# EasyEDA Pro project 4090_Portable_Fan.epro, schematic Schematic1_3
Board Name: 单节电池主板; Create Date: 2025-02-24; Page Name: P1; Project Name: 基于STC8G的风扇控制主板; Schematic Name: Schematic1; Update Date: 2025-12-03; BladeWidth: 10; Company: 嘉立创EDA; Page Size: A4; RegionStart: 1; ShowBorder: 1; TitleBlock: 1; TitleBlockPosition: 3; Version: V1.0; XRegionCount: 6; YRegionCount: 4
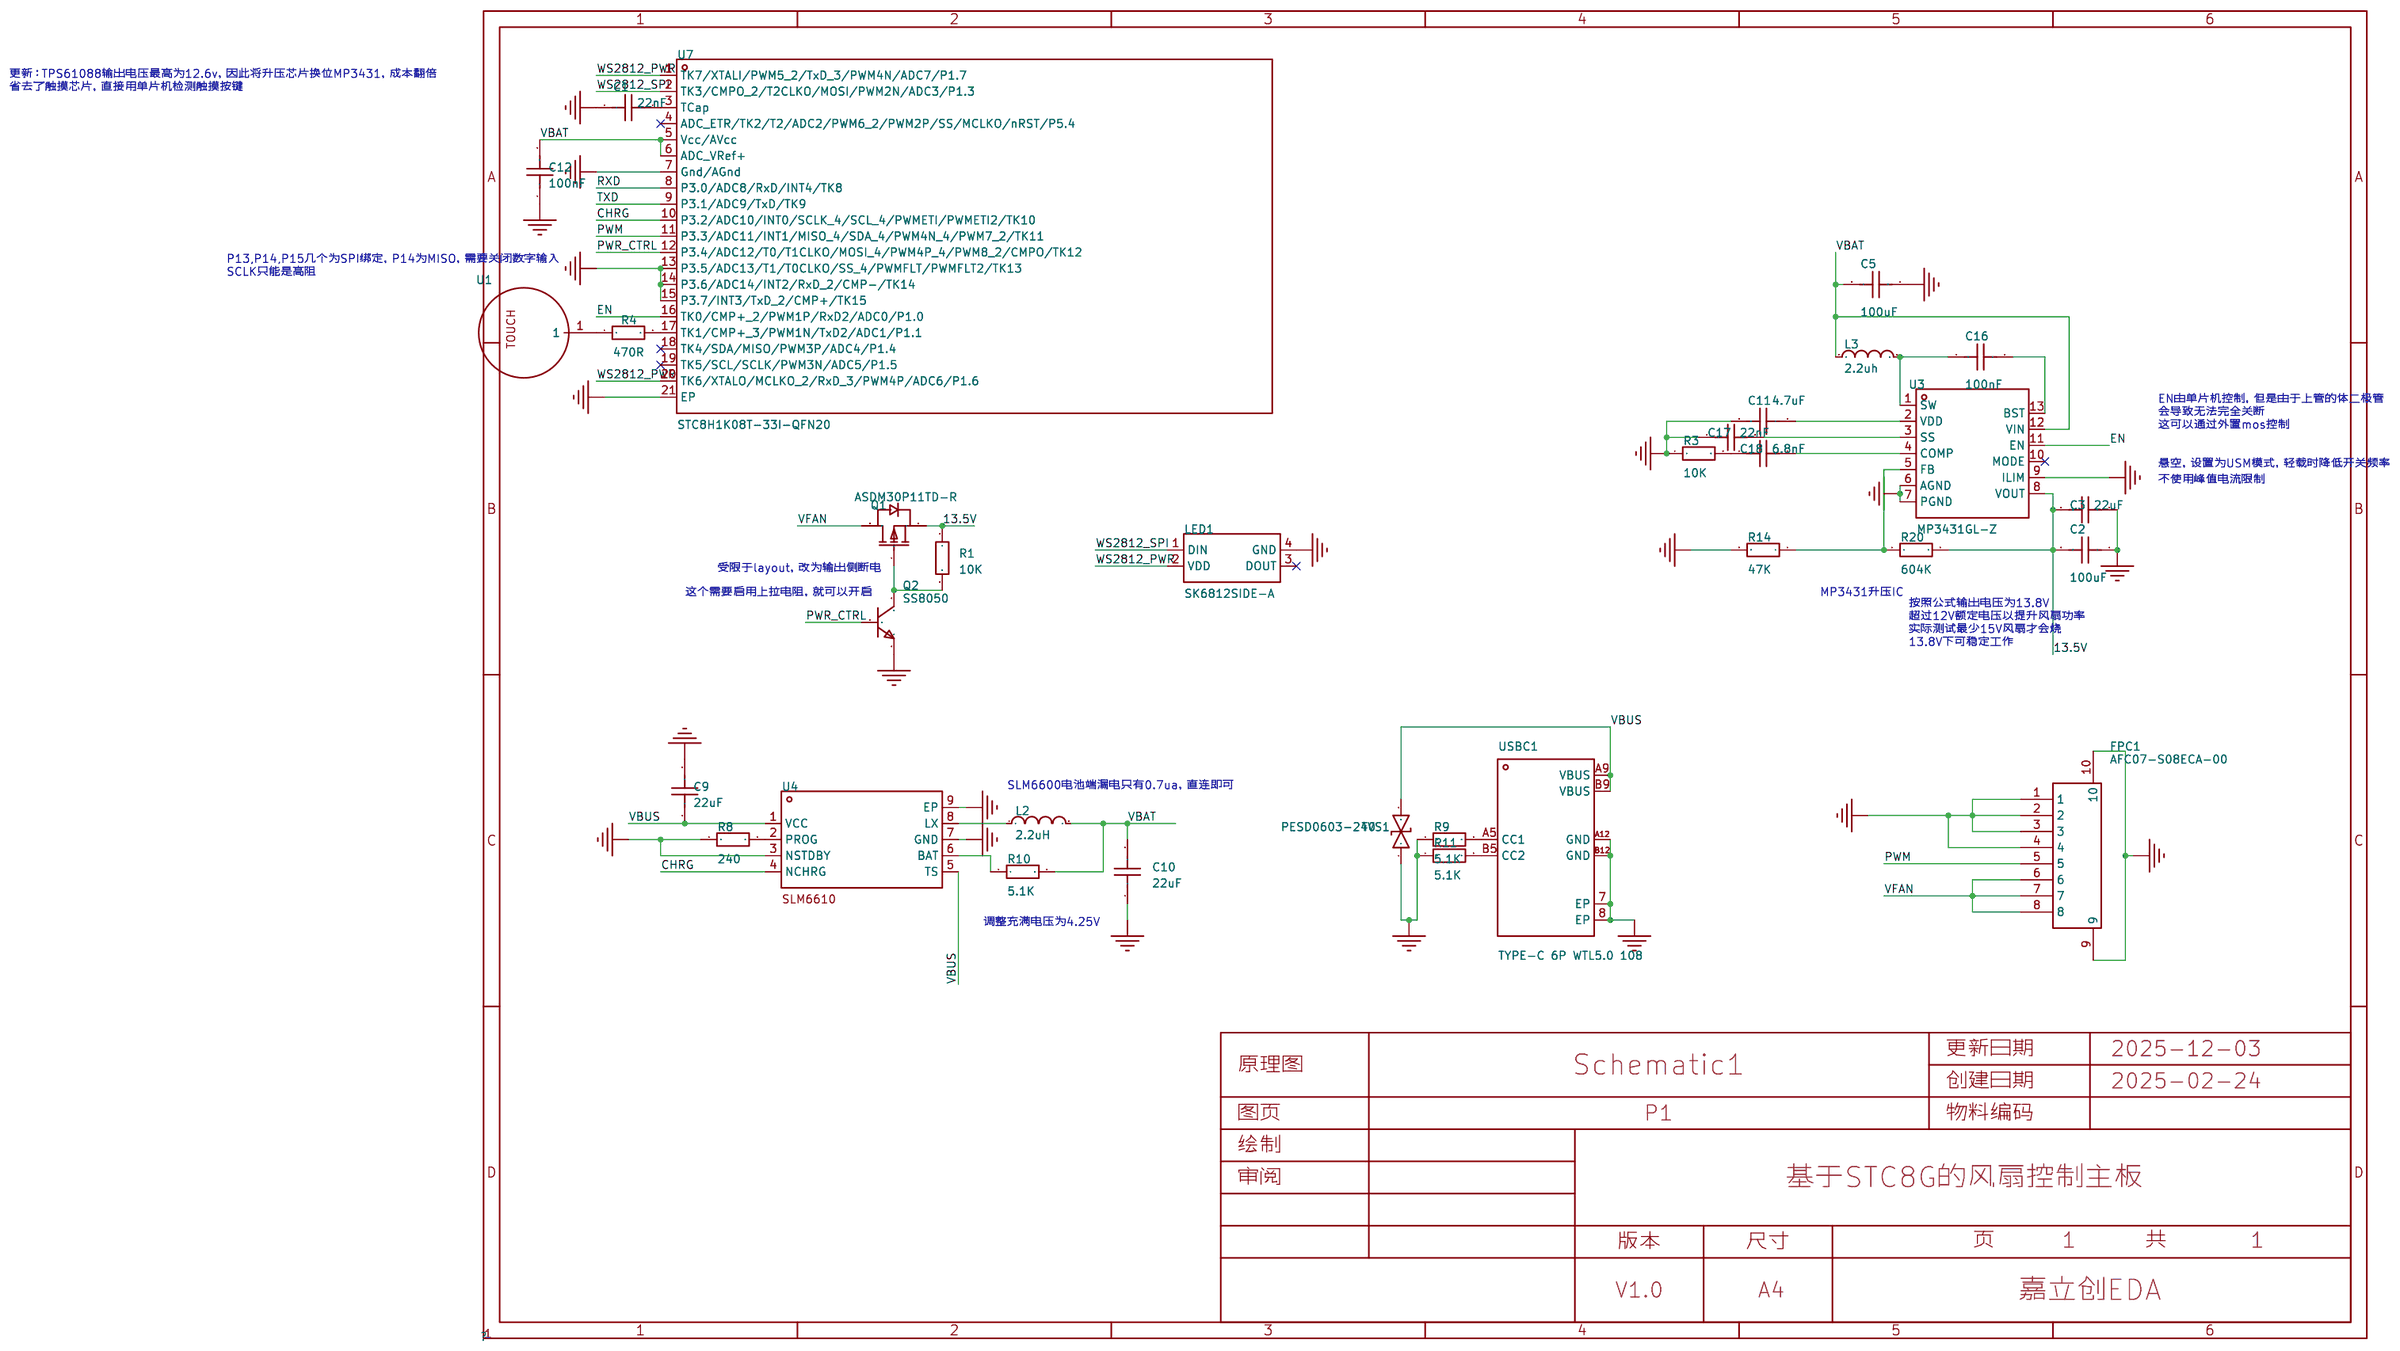
[diagram p0: schematic sheet]

## Parts
C1  22nF  [0805_S]
C2  100uF  [C1210]
C3  22uF  [0805_S]
C5  100uF  [C1210]
C9  22uF  [0805_S]
C10  22uF  [0805_S]
C11  4.7uF  [0805_S]
C12  100nF  [0805_S]
C16  100nF  [0805_S]
C17  22nF  [0805_S]
C18  6.8nF  [0805_S]
FPC1  AFC07-S08ECA-00  [FPC-SMD_P0.5-8P_LCS-SH-H2.0]
L2  2.2uH  [IND-SMD_L7.0-W6.6]
L3  2.2uh  [IND-SMD_L7.0-W6.6_MCW-0650-220]
LED1  SK6812SIDE-A  [LED-SMD_4P-L4.0-W1.6-L]
Q1  ASDM30P11TD-R  [DFN-8_L3.0-W3.0-P0.65-BL]
Q2  SS8050  [SOT-23-3_L2.9-W1.3-P1.90-LS2.4-BR]
R1  10K  [0805_S]
R3  10K  [0805_S]
R4  470R  [0805_S]
R8  240  [0805_S]
R9  5.1K  [0805_S]
R10  5.1K  [0805_S]
R11  5.1K  [0805_S]
R14  47K  [0805_S]
R20  604K  [0805_S]
TVS1  PESD0603-240  [D0603-BI]
U1  -  [F9-10-6-0.4喇叭口无针触摸弹簧]
U3  MP3431GL-Z  [QFN-13_L3.0-W4.0-P0.50-BL]
U4  -  [DFN-8_L3.0-W3.0-P0.65-BL-EP_AOZ6662DI]
U7  STC8H1K08T-33I-QFN20  [QFN-20_L3.0-W3.0-P0.40-TL-EP1.5]
USBC1  TYPE-C 6P WTL5.0 108  [USB-C-SMD_TYPE-C-6P-WTL5.0-108]

## Library data of the parts
C1 C3 C9-C12 C16-C18 = CAP_0603: Supplier Footprint: 0603
C2 C5 = HGC1210R5107M160NSVK: 容值:100uF;精度:±20%;额定电压:16V;温度系数:X5R;; LCSC Part Name: 100uF ±20% 16V; Supplier Part: C7432790; Manufacturer: Chinocera(华瓷); Supplier Footprint: 1210; JLCPCB Part Class: Extended Part; Datasheet: https://item.szlcsc.com/datasheet/HGC1210R5107M160NSVK/8438272.html; Supplier: LCSC; Tolerance: ±20%; Voltage Rating: 16V; Temperature Coefficient: X5R
FPC1 = AFC07-S08ECA-00: 锁定特性:抽屉式;触点类型:上接;触点数量:8P;间距:0.5mm;安装类型:卧贴;; LCSC Part Name: 间距:0.5mm P数:8P 抽屉式 上接; Supplier Part: C262581; Manufacturer: JS(钜硕电子); Supplier Footprint: SMD,P=0.5mm,卧贴; JLCPCB Part Class: Extended Part; Datasheet: https://atta.szlcsc.com/upload/public/pdf/source/20190726/C11082_A2E7B12387019CE4314BB5199EE0FDF4.pdf; Supplier: LCSC; Locking Feature: 抽屉式; Contact Type: 上接; Number of Contacts: 8P; Pitch: 0.5mm; Mounting Type: 卧贴; FFC, FCB Thickness: 0.3mm; Height Above Board: 2mm
L2 = FXL0630-2R2-M: 电感值:2.2uH;精度:±20%;额定电流:9.5A;饱和电流(Isat):10A;类型:一体成型电感;; LCSC Part Name: 2.2uH ±20% 10A; Supplier Part: C167218; Manufacturer: cjiang(长江微电); Supplier Footprint: SMD,6.6x7mm; JLCPCB Part Class: 扩展库; Datasheet: https://atta.szlcsc.com/upload/public/pdf/source/20240426/3189EA8206330E2108542F9E34E540E7.pdf; Supplier: LCSC; Tolerance: ±20%; Rated Current: 9.5A; Saturation Current (Isat): 10A; DC Resistance (DCR): 15mΩ; Type: 一体成型电感
L3 = FXL0650-2R2-M: 电感值:2.2uH;精度:±20%;额定电流:9A;饱和电流(Isat):11A;类型:一体成型电感;; LCSC Part Name: 2.2uH ±20% 11A; Supplier Part: C475528; Manufacturer: cjiang(长江微电); Supplier Footprint: SMD,6.6x7mm; JLCPCB Part Class: Extended Part; Datasheet: https://atta.szlcsc.com/upload/public/pdf/source/20240426/3189EA8206330E2108542F9E34E540E7.pdf; Supplier: LCSC; Tolerance: ±20%; Rated Current: 9A; Saturation Current (Isat): 11A; DC Resistance (DCR): 12.5mΩ; Type: 一体成型电感
LED1 = SK6812SIDE-A_C5378721: Supplier Part: C5378721; Manufacturer: 欧思科光电; Supplier Footprint: SMD-4P,4x1.6mm; JLCPCB Part Class: Extended Part; Datasheet: https://item.szlcsc.com/datasheet/SK6812SIDE-A/6242292.html; Supplier: LCSC
Q1 = ASDM30P11TD-R: 数量:1个P沟道;漏源电压(Vdss):30V;连续漏极电流(Id):55A;导通电阻(RDS(on)):8mΩ@10V;耗散功率(Pd):31.2W;阈值电压(Vgs(th)):2.5V@250uA;; LCSC Part Name: P沟道,电流:-55A,耐压:-30V; Supplier Part: C2758227; Manufacturer: ASDsemi(安森德); Supplier Footprint: DFN-8(3x3); JLCPCB Part Class: 扩展库; Datasheet: https://item.szlcsc.com/datasheet/ASDM30P11TD-R/2875934.html; Supplier: LCSC; Number: 1个P沟道; Drain to Source Voltage: 30V; Current - Continuous Drain(Id): 55A; RDS(on): 8mΩ@10V; Pd - Power Dissipation: 31.2W; Gate Threshold Voltage (Vgs(th)): 2.5V@250uA; Gate Charge(Qg): 61nC@10V; Input Capacitance(Ciss): 3.482nF; Reverse Transfer Capacitance (Crss@Vds): 309pF; Operating Temperature: -55℃~+150℃; Type: P沟道; Output Capacitance(Coss): 400pF
Q2 = SS8050_C7420370: 晶体管类型:NPN;集电极电流(Ic):1.5A;集射极击穿电压(Vceo):25V;耗散功率(Pd):300mW;直流电流增益(hFE):120@100mA,1.0V;; LCSC Part Name: H档 200-350 NPN 电流:1.5A 电压:25V; Supplier Part: C7420370; Manufacturer: R+O(宏嘉诚); Supplier Footprint: SOT-23; JLCPCB Part Class: Extended Part; Datasheet: https://item.szlcsc.com/datasheet/SS8050/8397192.html; Supplier: LCSC; type: NPN; Current - Collector(Ic): 1.5A; Collector - Emitter Voltage VCEO: 25V; Pd - Power Dissipation: 300mW; DC Current Gain: 120@100mA,1.0V; Transition frequency(fT): 100MHz; Current - Collector Cutoff: 100nA; Vce Saturation(VCE(sat)): 500mV; Operating Temperature: -55℃~+150℃; Emitter-Base Voltage(Vebo): 5V
R1 R8-R11 = Res_0603: Supplier Footprint: 0603
R3 R4 R14 R20 = Res_604: Supplier Footprint: 0603
TVS1 = PESD0603-240_C2929617: 钳位电压:45V;击穿电压:-;; Supplier Part: C2929617; Manufacturer: Littelfuse(美国力特); Supplier Footprint: 0603; JLCPCB Part Class: 扩展库; Datasheet: https://atta.szlcsc.com/upload/public/pdf/source/20180516/C207186_7CE2F9DCABF8CE4AA3105E54FFDB24F6.pdf; Supplier: LCSC; Clamping Voltage: 45V; Number of Channels: 单路; Type: ESD
U1 = F9-10-6-0.4喇叭口无针触摸弹簧
U3 = MP3431GL-Z: Supplier Part: C141829; Manufacturer: MPS(芯源); Supplier Footprint: QFN-13(3x4); JLCPCB Part Class: 扩展库; Datasheet: https://atta.szlcsc.com/upload/public/pdf/source/20240129/94E223583DDBF22DC95926308B8D1F4F.pdf; Supplier: LCSC
U4 = SLM6610: 5V3A同步降压，单节锂电池充电芯片
U7 = STC8H1K08T-33I-QFN20: 触摸按键/RTC; LCSC Part Name: 宽电压/高速/高可靠/低功耗/强抗静电/较强抗干扰的新一代 8051 单片机; Supplier Part: C20613530; Manufacturer: STC(宏晶); Supplier Footprint: QFN-20(3x3); JLCPCB Part Class: Extended Part; Datasheet: https://atta.szlcsc.com/upload/public/pdf/source/20240618/DD489B573D1BD2B3709AD37240A6CFF1.pdf; Supplier: LCSC
USBC1 = TYPE-C 6P WTL5.0 108: 连接器类型:Type-C;公母:母;安装方式:卧贴;触点数量:6P;端口数量:1;额定电流 - 电源:3A;工作温度范围:-20℃~+85℃;; LCSC Part Name: Type-C 母 卧贴; Supplier Part: C30167323; Manufacturer: SHOU HAN(首韩); Supplier Footprint: SMD; JLCPCB Part Class: 扩展库; Datasheet: https://atta.szlcsc.com/upload/public/pdf/source/20240719/5FA0E35FE16D69FE6470A929035FA38A.pdf; Supplier: LCSC; Connector Type: Type-C; Gender: 母; Mounting Style: 卧贴; Number of Contacts: 6P; Number of Ports: 1; Current Rating - Power (Max): 3A; Rated Voltage (Max): 5V; Connect-Disconnect Life: 5千次; Length: 5mm; Core Colour: 黑色; Operating Temperature Range: -20℃~+85℃

## Nets
13.5V: C2.2 C3.2 Q1.1(S) Q1.2(S) Q1.3(S) R1.1 R20.2 U3.8(VOUT)
GND: C1.2 C2.1 C3.1 C5.1 C9.2 C10.1 C11.1 C12.1 C17.1 FPC1.1 FPC1.2 FPC1.3 FPC1.4 FPC1.9 FPC1.10 LED1.4(GND) Q2.2(E) R3.1 R8.1 R9.1 R11.1 R14.2 TVS1.1 U3.6(AGND) U3.7(PGND) U3.9(ILIM) U4.3(NSTDBY) U4.7(GND) U4.9(EP) U7.7(Gnd/AGnd) U7.13(P3.5/ADC13/T1/T0CLKO/SS_4/PWMFLT/PWMFLT2/TK13) U7.14(P3.6/ADC14/INT2/RxD_2/CMP-/TK14) U7.15(P3.7/INT3/TxD_2/CMP+/TK15) U7.21(EP) USBC1.7(EP) USBC1.8(EP) USBC1.A12(GND) USBC1.B12(GND)
VBAT: C5.2 C10.2 C12.2 L2.2 L3.1 R10.2 U3.12(VIN) U7.5(Vcc/AVcc) U7.6(ADC_VRef+)
VBUS: C9.1 TVS1.2 U4.1(VCC) U4.5(TS) USBC1.A9(VBUS) USBC1.B9(VBUS)
CHRG: U4.4(NCHRG) U7.10(P3.2/ADC10/INT0/SCLK_4/SCL_4/PWMETI/PWMETI2/TK10)
EN: U3.11(EN) U7.16(TK0/CMP+_2/PWM1P/RxD2/ADC0/P1.0)
PWM: FPC1.5 U7.11(P3.3/ADC11/INT1/MISO_4/SDA_4/PWM4N_4/PWM7_2/TK11)
PWR_CTRL: Q2.1(B) U7.12(P3.4/ADC12/T0/T1CLKO/MOSI_4/PWM4P_4/PWM8_2/CMPO/TK12)
RXD: U7.8(P3.0/ADC8/RxD/INT4/TK8)
TXD: U7.9(P3.1/ADC9/TxD/TK9)
VFAN: FPC1.6 FPC1.7 FPC1.8 Q1.5(D) Q1.6(D) Q1.7(D) Q1.8(D) Q1.9(D)
WS2812_PWR: LED1.2(VDD) U7.1(TK7/XTALI/PWM5_2/TxD_3/PWM4N/ADC7/P1.7) U7.20(TK6/XTALO/MCLKO_2/RxD_3/PWM4P/ADC6/P1.6)
WS2812_SPI: LED1.1(DIN) U7.2(TK3/CMPO_2/T2CLKO/MOSI/PWM2N/ADC3/P1.3)
$1N19622: R9.2 USBC1.A5(CC1)
$1N19624: R11.2 USBC1.B5(CC2)
$1N43229: Q1.4(G) Q2.3(C) R1.2
$1N43235: R10.1 U4.6(BAT)
$1N43239: L2.1 U4.8(LX)
$1N43243: R8.2 U4.2(PROG)
$1N43289: C1.1 U7.3(TCap)
$1N43298: C11.2 U3.2(VDD)
$1N43300: C16.2 U3.13(BST)
$1N43301: C16.1 L3.2 U3.1(SW)
$1N43302: C17.2 U3.3(SS)
$1N43303: C18.2 U3.4(COMP)
$1N43304: C18.1 R3.2
$1N43305: R14.1 R20.1 U3.5(FB)
$1N43333: R4.2 U7.17(TK1/CMP+_3/PWM1N/TxD2/ADC1/P1.1)
$1N43334: R4.1 U1.1

Not connected (* = marked no-connect by the designer): LED1 3(DOUT)*; U3 10(MODE)*; U7 4(ADC_ETR/TK2/T2/ADC2/PWM6_2/PWM2P/SS/MCLKO/nRST/P5.4)* 18(TK4/SDA/MISO/PWM3P/ADC4/P1.4)* 19(TK5/SCL/SCLK/PWM3N/ADC5/P1.5)*

## Notes on the sheet
- 更新：TPS61088输出电压最高为12.6v，因此将升压芯片换位MP3431，成本翻倍
  省去了触摸芯片，直接用单片机检测触摸按键
- P13,P14,P15几个为SPI绑定，P14为MISO，需要关闭数字输入
  SCLK只能是高阻
- EN由单片机控制，但是由于上管的体二极管
  会导致无法完全关断
  这可以通过外置mos控制
- 悬空，设置为USM模式，轻载时降低开关频率
- 不使用峰值电流限制
- 受限于layout，改为输出侧断电
- 这个需要启用上拉电阻，就可以开启
- MP3431升压IC
- 按照公式输出电压为13.8V
  超过12V额定电压以提升风扇功率
  实际测试最少15V风扇才会烧
  13.8V下可稳定工作
- SLM6600电池端漏电只有0.7ua，直连即可
- 调整充满电压为4.25V
